# EAGLE design Gimbal-Breakout (EAGLE 8.0.0)
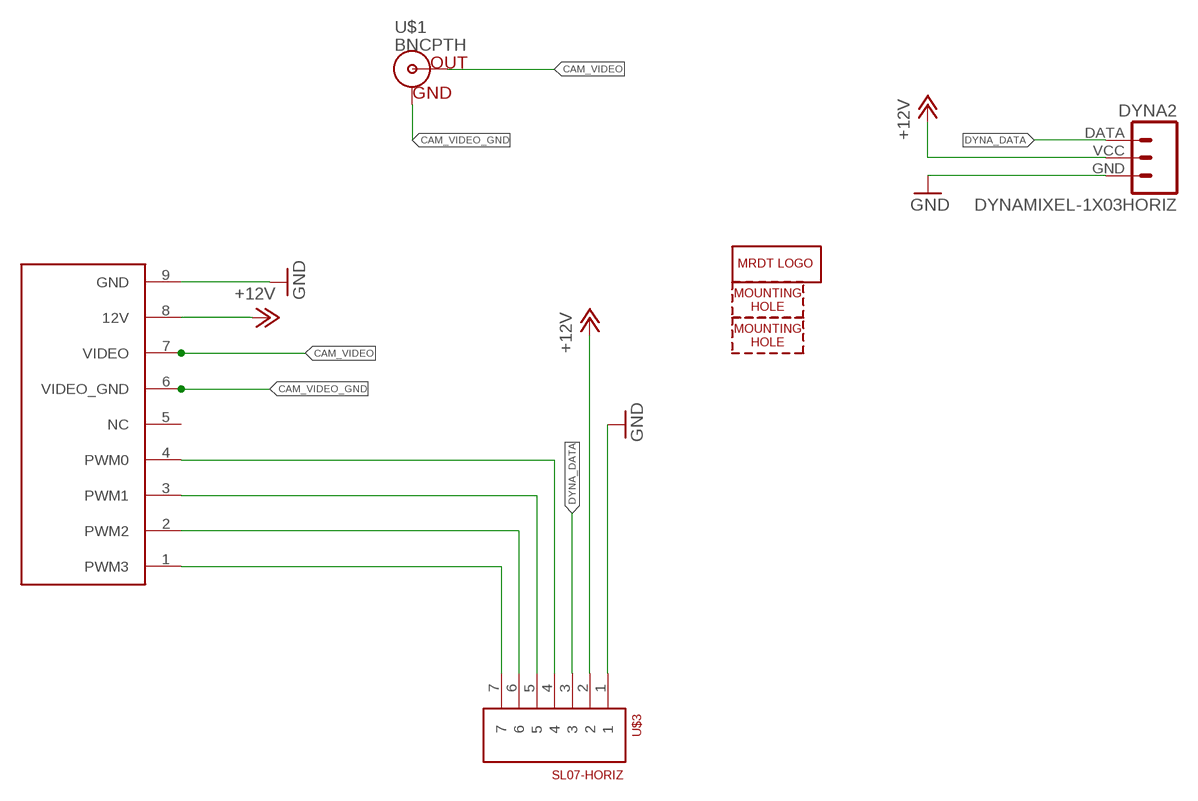
[diagram p0: schematic, sheet 1]

## Parts
DYNA2  DYNAMIXEL-1X03HORIZ  [MLX-SPOX5268-3PIN]
H1  MOUNTING_HOLE#4  [#4_SCREW]
H2  MOUNTING_HOLE#4  [#4_SCREW]
LOGO1  MRDT_LOGO  [MRDT_LOGO]
U$1  BNCPTH  [BNC]
U$3  SL07-HORIZ  [MOLEX-70551-0006]
U$4  CAMERA_BREAKOUT  [CAM_CONNECTOR]

## Nets
+12V: DYNA2.VCC U$3.2 U$4.8(12V)
CAM_PWM0: U$3.4 U$4.4(PWM0)
CAM_PWM1: U$3.5 U$4.3(PWM1)
CAM_PWM2: U$3.6 U$4.2(PWM2)
CAM_PWM3: U$3.7 U$4.1(PWM3)
CAM_VIDEO: U$1.S(OUT) U$4.7(VIDEO)
CAM_VIDEO_GND: U$1.GND U$4.6(VIDEO_GND)
DYNA_DATA: DYNA2.DATA U$3.3
GND: DYNA2.GND U$3.1 U$4.9(GND)
Unconnected: U$4.5(NC)

## Library data of the parts
DYNA2 = MRDT-2015-Arm:DYNAMIXEL-1X03; MFR: Molex; MFR_PN: 0022057035; ORIENT: Horiz
H1 H2 = MRDT-Hardware:MOUNTING_HOLE: Mounting hole for M6 bolt. Standard use mounting hole for: Tiva C Connected - M6 Anderson Powerpole Mounting Wing - M8 Most frame-mounted PCB's - M8
LOGO1 = MRDT-Hardware:MRDT_LOGO
U$1 = SparkFun-Connectors:BNC: BNC Connector, Mouser Part# 5227161
U$3 = MRDT-Connectors:SL07
U$4 = MRDT-2015-General:CAMERA_BREAKOUT: Breakout board for the rover's main camera

## Board
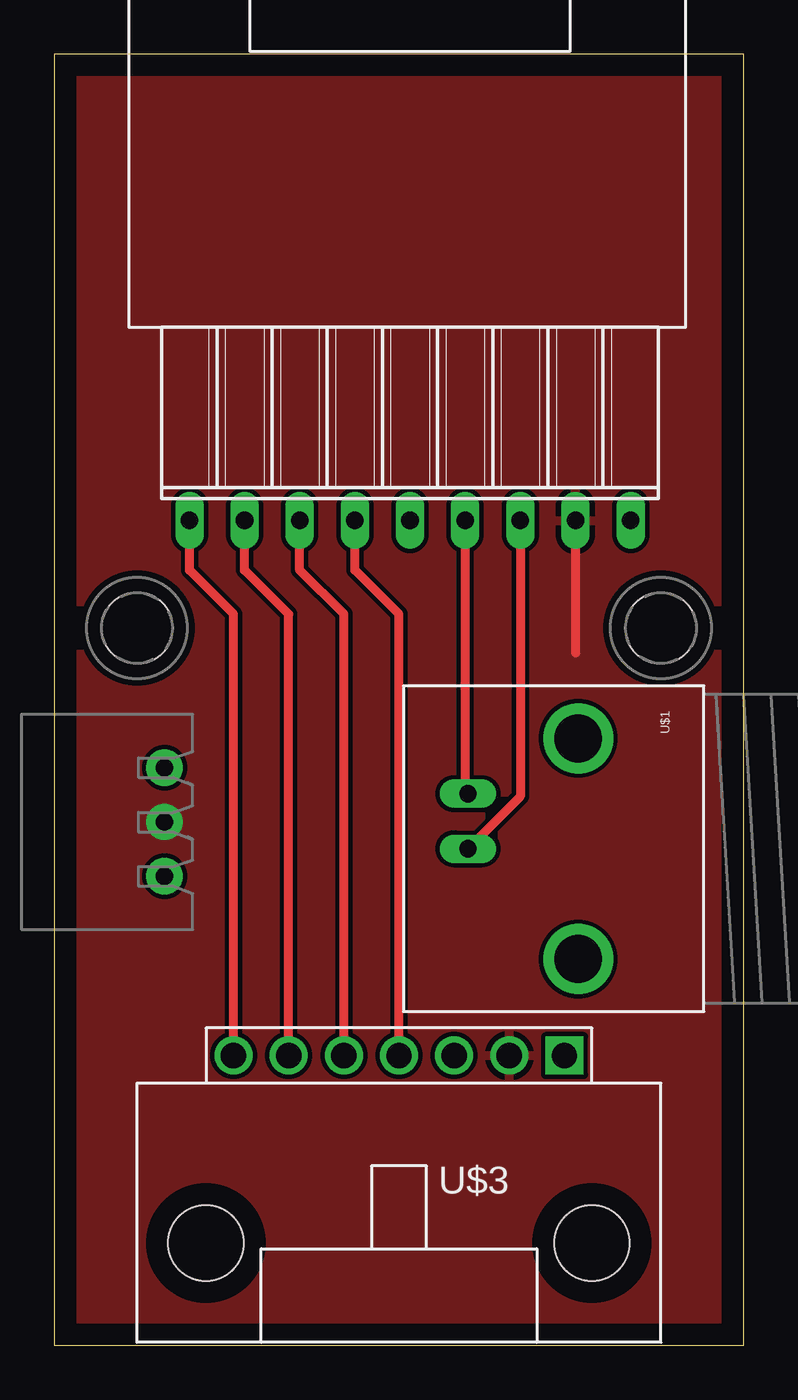
[diagram p1: board, top side]
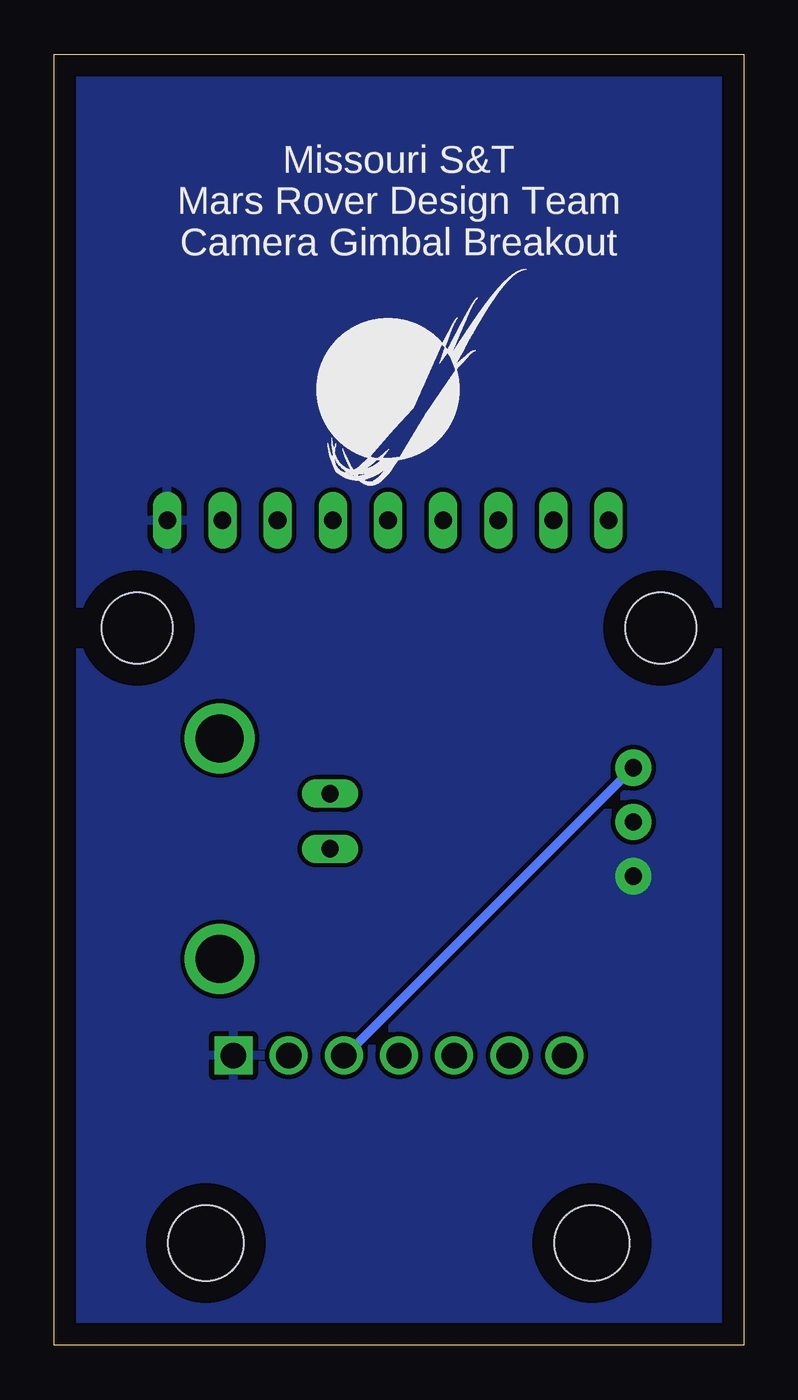
[diagram p2: board, bottom side, seen from below]

Size 31.75 x 59.44 mm. Coordinates in mm from the lower left corner, seen from the top.
Outline: 0,0 31.75,0 31.75,59.44 0,59.44 0,0
Copper layers (1*16): Top 0.035mm / dielectric 1.5mm / Bottom 0.035mm
Design rules "default": minimum track width 10mil, minimum drill 24mil, track to track 8mil, track to pad 8mil, pad to pad 8mil, via to via 8mil, smd to smd 8mil, copper to edge 40mil, drill to drill 8mil, minimum pad ring 10mil, minimum via ring 8mil, stop-mask expansion 4mil, vias tented up to drill 0mil, thermal gap 10mil

### Footprints (pad centres in the part's own frame; a part is rotated, then mirrored left to right if it is on the bottom)
MLX-SPOX5268-3PIN = drill 0.8 pad 1.676: DATA 5,0; GND 0,0; VCC 2.5,0
#4_SCREW = hole 3.264: 0,0
BNC = drill 2.2: 3 -5.08,5.08; 4 5.08,5.08 | drill 0.8 long: GND -2.54,0; S 0,0
MOLEX-70551-0006 = drill 1.168 square: 1 -7.62,0 | drill 1.168: 2 -5.08,0; 3 -2.54,0; 4 0,0; 5 2.54,0; 6 5.08,0; 7 7.62,0 | hole 3.454: -8.89,8.636; 8.89,8.636
CAM_CONNECTOR = drill 0.813 long: 1 3.048,1.778; 2 5.588,1.778; 3 8.128,1.778; 4 10.668,1.778; 5 13.208,1.778; 6 15.748,1.778; 7 18.288,1.778; 8 20.828,1.778; 9 23.368,1.778

### Placement (x,y rotation side)
DYNA2  5.08,21.59 90 top
H1  3.81,33.02 0 top
H2  27.94,33.02 0 top
LOGO1  19.68,38.73 0 bottom
U$1  19.05,22.86 270 top
U$3  15.88,13.34 180 top
U$4  3.17,36.2 0 top

### Tracks (layer width: path | path; a pad name or v marks a point on that pad's centre or on a via)
+12V
  Top 0.406: U$4.8 24,31.88
  pour Top: -12.7,-7.62 58.42,-7.62 58.42,68.58 -12.7,68.58
CAM_PWM0
  Top 0.406: U$3.4 15.88,33.66 13.84,35.69 U$4.4
CAM_PWM1
  Top 0.406: U$3.5 13.34,33.66 11.3,35.69 U$4.3
CAM_PWM2
  Top 0.406: U$3.6 10.79,33.66 8.76,35.69 U$4.2
CAM_PWM3
  Top 0.406: U$3.7 8.26,33.66 6.22,35.69 U$4.1
CAM_VIDEO
  Top 0.406: U$4.7 21.46,25.27 U$1.S
CAM_VIDEO_GND
  Top 0.406: U$4.6 18.92,25.53 U$1.GND
DYNA_DATA
  Bottom 0.406: U$3.3 18.34,13.34 DYNA2.DATA
GND
  pour Bottom: -7.62,-5.08 53.34,-5.08 53.34,64.77 -7.62,64.77

### Text on the board
bPlace: Missouri S&T / Mars Rover Design Team / Camera Gimbal Breakout